# EAGLE design OpenFileWithEagle6.5 (EAGLE 6.6.0)
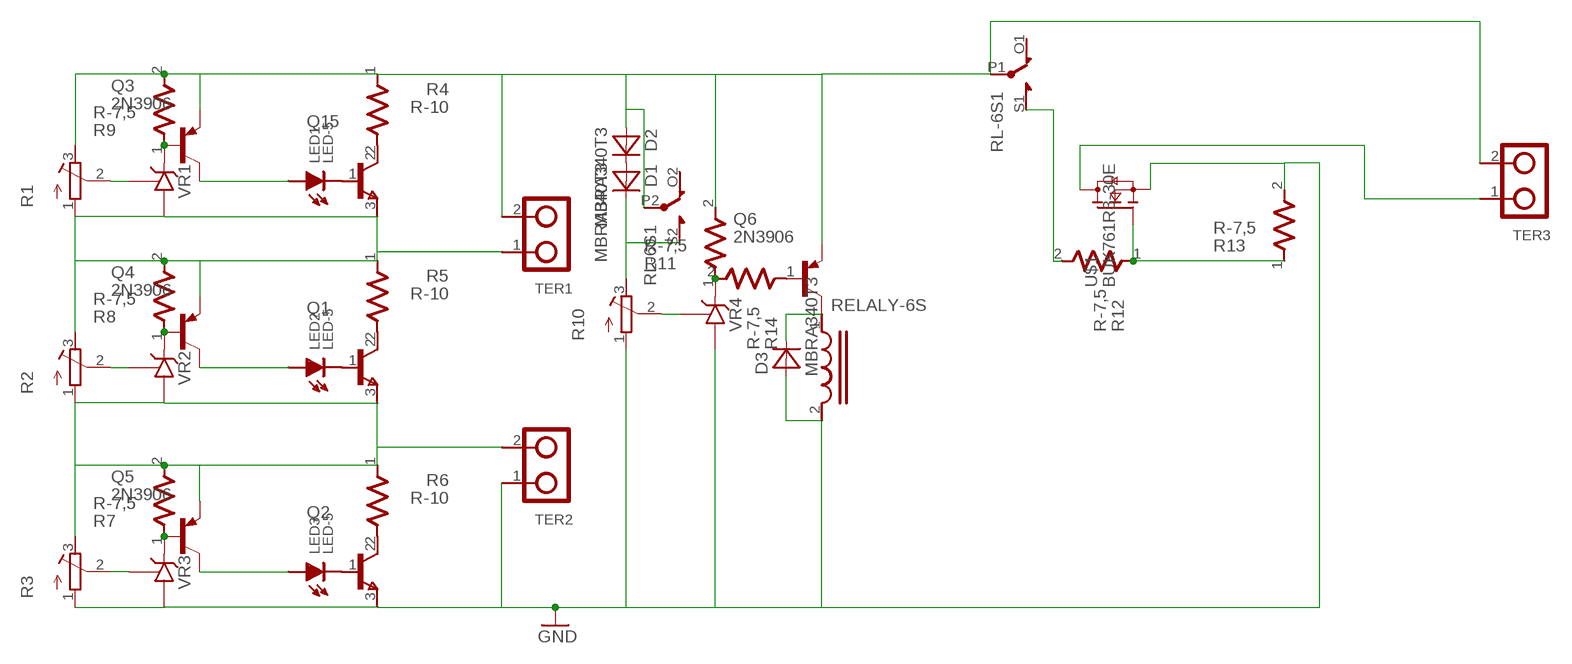
[diagram p0: schematic, sheet 1]

## Parts
D1  MBRA340T3  [SMA]
D2  MBRA340T3  [SMA]
D3  MBRA340T3  [SMA]
LED1  LED-5  [LED5]
LED2  LED-5  [LED5]
LED3  LED-5  [LED5]
Q1  C1815  [TO92L]
Q2  C1815  [TO92L]
Q3  2N3906  [TO92]
Q4  2N3906  [TO92]
Q5  2N3906  [TO92]
Q6  2N3906  [TO92]
Q15  C1815  [TO92L]
R1  R-TRIMM64W  [RTRIM64W]
R2  R-TRIMM64W  [RTRIM64W]
R3  R-TRIMM64W  [RTRIM64W]
R4  R-10  [R-10]
R5  R-10  [R-10]
R6  R-10  [R-10]
R7  R-7,5  [R-7,5]
R8  R-7,5  [R-7,5]
R9  R-7,5  [R-7,5]
R10  R-TRIMM64W  [RTRIM64W]
R11  R-7,5  [R-7,5]
R12  R-7,5  [R-7,5]
R13  R-7,5  [R-7,5]
R14  R-7,5  [R-7,5]
RL-6S1  RELALY-6S  [RELAY-6S]
TER1  DOMINO-2  [DOMI-2]
TER2  DOMINO-2  [DOMI-2]
TER3  DOMINO-2  [DOMI-2]
U$1  BUK761R3-30E  [SOT404]
VR1  TL431CLP  [TO92-CLP]
VR2  TL431CLP  [TO92-CLP]
VR3  TL431CLP  [TO92-CLP]
VR4  TL431CLP  [TO92-CLP]

## Nets
GND: D3.A Q2.3(E) R3.1(A) R10.1(A) R13.2 RL-6S1.2 TER2.1 U$1.3(S) VR3.A VR4.A
N$1: LED1.K Q15.1(B)
N$2: LED2.K Q1.1(B)
N$3: LED3.K Q2.1(B)
N$4: R10.2(S) VR4.R
N$5: R11.1 R14.2 VR4.C
N$6: Q6.2(B) R14.1
N$7: R2.2(S) VR2.R
N$8: R3.2(S) VR3.R
N$9: Q3.2(B) R9.1 VR1.C
N$10: Q4.2(B) R8.1 VR2.C
N$11: Q5.2(B) R7.1 VR3.C
N$12: LED2.A Q4.1(C)
N$13: LED3.A Q5.1(C)
N$14: LED1.A Q3.1(C)
N$15: Q15.2(C) R4.2
N$16: Q1.2(C) R5.2
N$17: Q2.2(C) R6.2
N$18: Q1.3(E) Q5.3(E) R2.1(A) R3.3(E) R6.1 R7.2 TER2.2 VR2.A
N$19: Q4.3(E) Q15.3(E) R1.1(A) R2.3(E) R5.1 R8.2 TER1.1 VR1.A
N$20: D2.A Q3.3(E) Q6.3(E) R1.3(E) R4.1 R9.2 R11.2 RL-6S1.P1(P) RL-6S1.P2(K:P) TER1.2 TER3.2
N$21: R1.2(S) VR1.R
N$22: D3.C Q6.1(C) RL-6S1.1
N$23: TER3.1 U$1.MB(D)
N$25: D1.C R10.3(E) RL-6S1.S2(K:S)
N$26: R12.1 R13.1 U$1.1(G)
N$27: D1.A D2.C
N$28: R12.2 RL-6S1.S1(S)
Unconnected: RL-6S1.O1(O) RL-6S1.O2(K:O)

## Library data of the parts
D1-D3 = diode:MBRA340T3: Surface Mount Schottky Power Rectifier Source: http://www.onsemi.com/pub_link/Collateral/MBRA340T3-D.PDF
LED1-LED3 = chuong:LED-5
Q1 Q2 Q15 = lbr:C1815
Q3-Q6 = lbr:2N3906: PNP Transistor
R1-R3 R10 = chuong:R-TRIMM: Trimm resistor
R4-R6 = lbr:R-10
R7-R9 R11-R14 = chuong:R-7,5
RL-6S1 = chuong:RELALY-6S
TER1-TER3 = chuong:DOMINO-2
U$1 = lbr:BUK761R3-30E: N-channel TrenchMOS standard level FET Standard level N-channel MOSFET in a SOT404 package using TrenchMOS technology. This product has been designed and qualified to AEC Q101 standard for use in high performance automotive applications. AAL Eindhoven MK
VR1-VR4 = chuong:TL431CLP: VOLTAGE REGULATOR

## Board
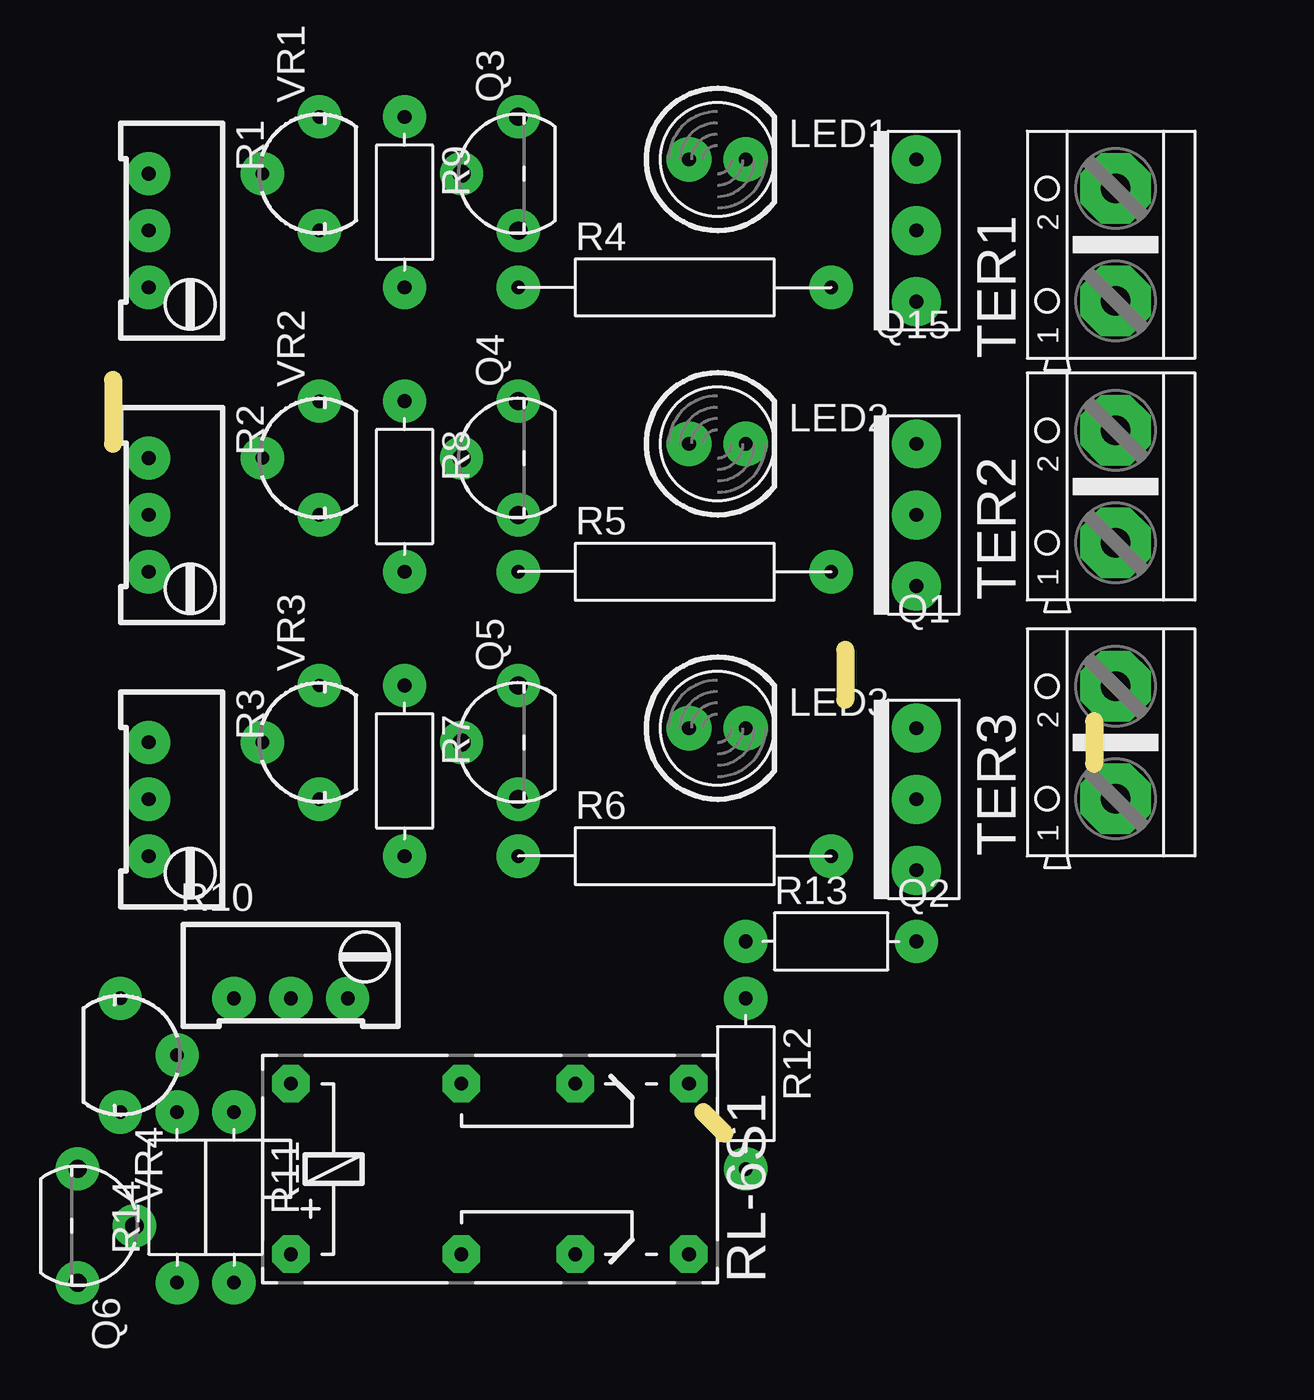
[diagram p1: board, top side]
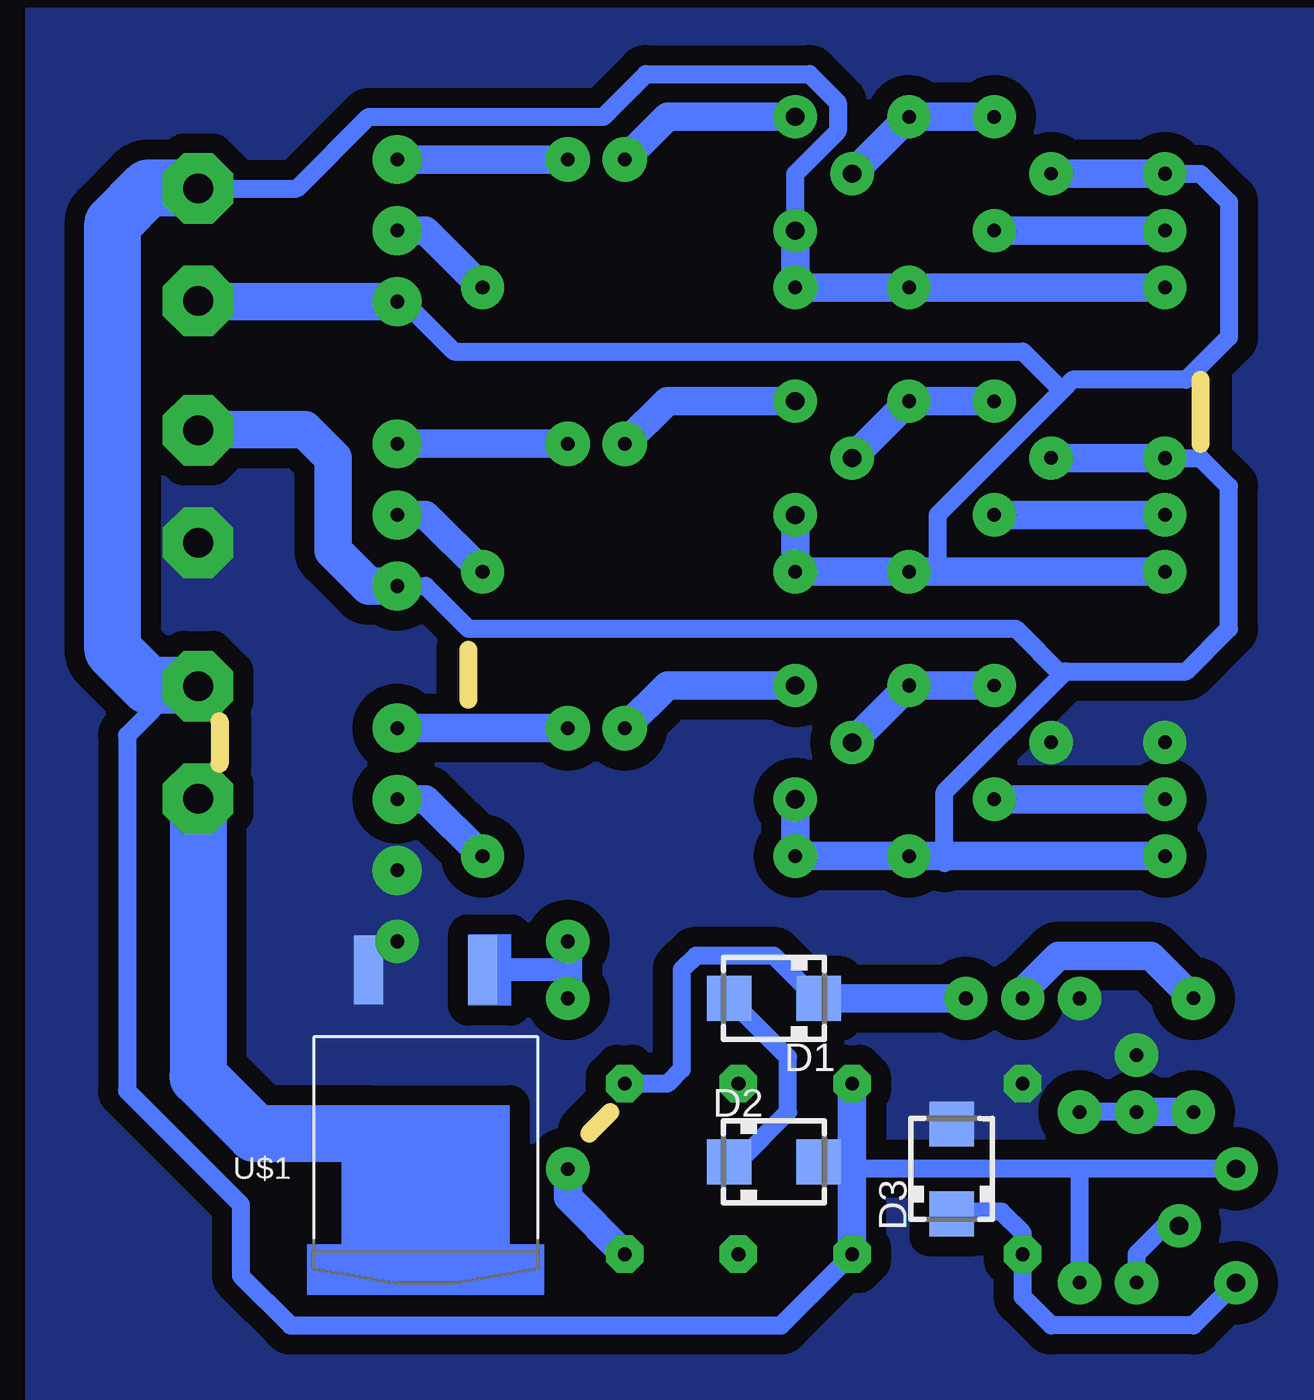
[diagram p2: board, bottom side, seen from below]

Size 43.81 x 33.66 mm. Coordinates in mm from the lower left corner, seen from the top.
Outline: 26.35,0.95 27.3,0
Outline: 32.7,21.59 32.7,19.37
Outline: 0,33.66 0,30.8
Outline: 43.82,18.41 43.82,16.51
Copper layers (1*16): Top 0.035mm / dielectric 1.5mm / Bottom 0.035mm
Design rules "default": minimum track width 10mil, minimum drill 24mil, track to track 8mil, track to pad 8mil, pad to pad 8mil, via to via 8mil, smd to smd 8mil, copper to edge 40mil, drill to drill 8mil, minimum pad ring 10mil, minimum via ring 8mil, stop-mask expansion 4mil, vias tented up to drill 0mil, thermal gap 10mil

### Footprints (pad centres in the part's own frame; a part is rotated, then mirrored left to right if it is on the bottom)
SMA = smd 2 x 2: A 2,0; C -2,0
LED5 = drill 0.61 pad 2: A -1.27,0; K 1.27,0
TO92L = drill 0.61 pad 2.184: 1 3.175,0; 2 0,0; 3 -3.175,0
TO92 = drill 0.813 pad 1.93: 1 2.54,0; 2 0,2.54; 3 -2.54,0
RTRIM64W = drill 0.61 pad 1.93: 1 1.27,-2.54; 2 1.27,0; 3 1.27,2.54
R-10 = drill 0.61 pad 1.93: 1 -7.62,0; 2 6.35,0
R-7,5 = drill 0.61 pad 1.93: 1 -3.81,0; 2 3.81,0
RELAY-6S = drill 0.61 pad 1.676 octagon: 1 -10.16,-3.81; 2 -10.16,3.81; O1 2.54,-3.81; O2 2.54,3.81; P1 -2.54,-3.81; P2 -2.54,3.81; S1 7.62,-3.81; S2 7.62,3.81
DOMI-2 = drill 1.321 pad 3.15 octagon: 1 -2.515,0; 2 2.515,0
SOT404 = smd 1.3 x 3.1: 1 -2.54,-6.35; 3 2.54,-6.35 | smd 0 x 0: MB 0,0
TO92-CLP = drill 0.6 pad 1.93: A 0,2.54; C 2.54,0; R -2.54,0

### Placement (x,y rotation side)
D1  19.05,6.03 180 bottom
D2  19.05,-1.27 0 bottom
D3  11.11,-1.59 90 bottom
LED1  26.99,43.5 0 top  (outside the outline)
LED2  26.99,30.8 0 top
LED3  26.99,18.1 0 top
Q1  35.88,27.62 90 top
Q2  35.88,14.92 90 top
Q3  18.1,42.86 90 top  (outside the outline)
Q4  18.1,30.16 90 top
Q5  18.1,17.46 90 top
Q6  -1.59,-4.13 270 top
Q15  35.88,40.32 90 top  (outside the outline)
R1  2.86,40.32 180 top  (outside the outline)
R2  2.86,27.62 180 top
R3  2.86,14.92 180 top
R4  25.72,37.78 0 top  (outside the outline)
R5  25.72,25.08 0 top
R6  25.72,12.38 0 top
R7  13.02,16.19 270 top
R8  13.02,28.89 270 top
R9  13.02,41.59 270 top  (outside the outline)
R10  7.94,7.3 270 top
R11  5.4,-2.86 270 top
R12  28.26,2.22 270 top
R13  32.07,8.57 0 top
R14  2.86,-2.86 90 top
RL-6S1  18.1,-1.59 0 top
TER1  44.77,39.69 90 top  (outside the outline)
TER2  44.77,28.89 90 top
TER3  44.77,17.46 90 top
U$1  34.61,0.95 180 bottom
VR1  9.21,42.86 90 top  (outside the outline)
VR2  9.21,30.16 90 top
VR3  9.21,17.46 90 top
VR4  0.32,3.49 270 top

### Tracks (layer width: path | path; a pad name or v marks a point on that pad's centre or on a via)
GND
  pour Bottom (isolate 0.889, no thermals): -5.08,50.16 52.39,50.16 52.39,-12.07 -5.08,-12.07
N$1
  Bottom 1.27: LED1.K Q15.1
N$2
  Bottom 1.27: LED2.K Q1.1
N$3
  Bottom 1.27: LED3.K Q2.1
N$4
  Bottom 1.27: R10.2 7.94,6.35 6.35,7.94 2.22,7.94 VR4.R
N$5
  Bottom 0.813: R14.2 R11.1
  Bottom 1.27: VR4.C R14.2
N$6
  Bottom 0.813: Q6.2 1.59,-4.13 2.86,-5.4 R14.1
N$7
  Bottom 1.27: R2.2 VR2.R
N$8
  Bottom 1.27: VR3.R R3.2
N$9
  Bottom 1.27: VR1.C R9.1 Q3.2
N$10
  Bottom 1.27: VR2.C R8.1 Q4.2
N$11
  Bottom 1.27: VR3.C R7.1 Q5.2
N$12
  Bottom 1.27: Q4.1 23.81,32.7 LED2.A
N$13
  Bottom 1.27: Q5.1 23.81,20 LED3.A
N$14
  Bottom 1.27: Q3.1 23.81,45.4 LED1.A
N$15
  Bottom 1.27: Q15.2 34.61,40.32 R4.2
N$16
  Bottom 1.27: Q1.2 34.61,27.62 R5.2
N$17
  Bottom 1.27: Q2.2 34.61,14.92 R6.2
N$18
  Bottom 0.813: R2.1 0,30.16 -1.27,28.89 -1.27,22.54 0.63,20.64 6.03,20.64 6.19,20.48 | Q1.3 34.61,24.45 32.7,22.54 8.26,22.54 6.19,20.48 | R3.3 11.11,12.38 11.43,12.07 11.43,15.24 6.19,20.48
  Bottom 1.27: R2.1 VR2.A | R3.3 R7.2 R6.1 Q5.3
  Bottom 1.676: TER2.2 44.74,31.43 40,31.43 38.74,30.16 38.74,26.03 37.15,24.45 Q1.3
N$19
  Bottom 0.813: R1.1 0,42.86 -1.27,41.59 -1.27,35.56 0.63,33.66 5.71,33.66 6.19,33.18 | 6.19,33.18 11.75,27.62 11.75,25.4 12.07,25.08 | Q15.3 35.56,37.15 33.34,34.92 7.94,34.92 6.19,33.18
  Bottom 1.27: R1.1 VR1.A | R2.3 12.07,25.08 R8.2 R5.1 Q4.3
  Bottom 1.676: Q15.3 44.74,37.15 TER1.1
N$20
  Bottom 0.813: Q3.3 18.1,42.86 16.19,44.77 16.19,46.04 17.46,47.31 24.76,47.31 26.67,45.4 37.15,45.4 40.35,42.2 TER1.2 | TER3.2 45.75,19.98 47.94,17.78 47.94,1.9 42.86,-3.17 42.86,-6.35 40.64,-8.57 18.73,-8.57 RL-6S1.P1 | Q6.3 5.4,-1.59 | 5.4,-1.59 15.24,-1.59 15.56,-1.91 | R11.2 5.4,-1.59
  Bottom 1.27: R1.3 R9.2 R4.1 Q3.3 | RL-6S1.P2 15.56,-1.27 | D2.A 15.56,-1.27 | RL-6S1.P1 15.56,-1.91 15.56,-1.27
  Bottom 2.54: TER3.2 44.79,20 46.99,20 48.58,21.59 48.58,40.64 46.99,42.23 44.79,42.23 TER1.2
N$21
  Bottom 1.27: R1.2 VR1.R
N$22
  Bottom 0.813: D3.C 11.02,-3.49 8.89,-3.49 7.94,-4.44 RL-6S1.1 7.94,-7.3 6.67,-8.57 0.32,-8.57 Q6.1
N$23
  Bottom 0.254: U$1.MB 36.2,0.95 37.15,0
  Bottom 2.54: TER3.1 44.77,2.54 42.23,0 37.15,0 34.61,-2.54
N$25
  Bottom 0.813: 17.05,6.26 17.37,6.26 19.05,7.94 22.54,7.94 23.18,7.3 23.18,2.86 23.81,2.22 RL-6S1.S2
  Bottom 1.27: R10.3 D1.C 17.05,6.26
N$26
  Bottom 1.016: 28.26,7.3 U$1.1
  Bottom 1.27: R13.1 28.26,7.3 R12.1
N$27
  Bottom 0.813: 21.27,-1.27 20.64,-1.27 18.41,0.95 18.41,3.4 D1.A
  Bottom 1.27: D2.C 21.27,-1.27
N$28
  Bottom 1.27: R12.2 28.26,-2.86 RL-6S1.S1
(copper drawn outside any net)
  shapes: Bottom area x1